# Altium project sensorbox.PrjPCB
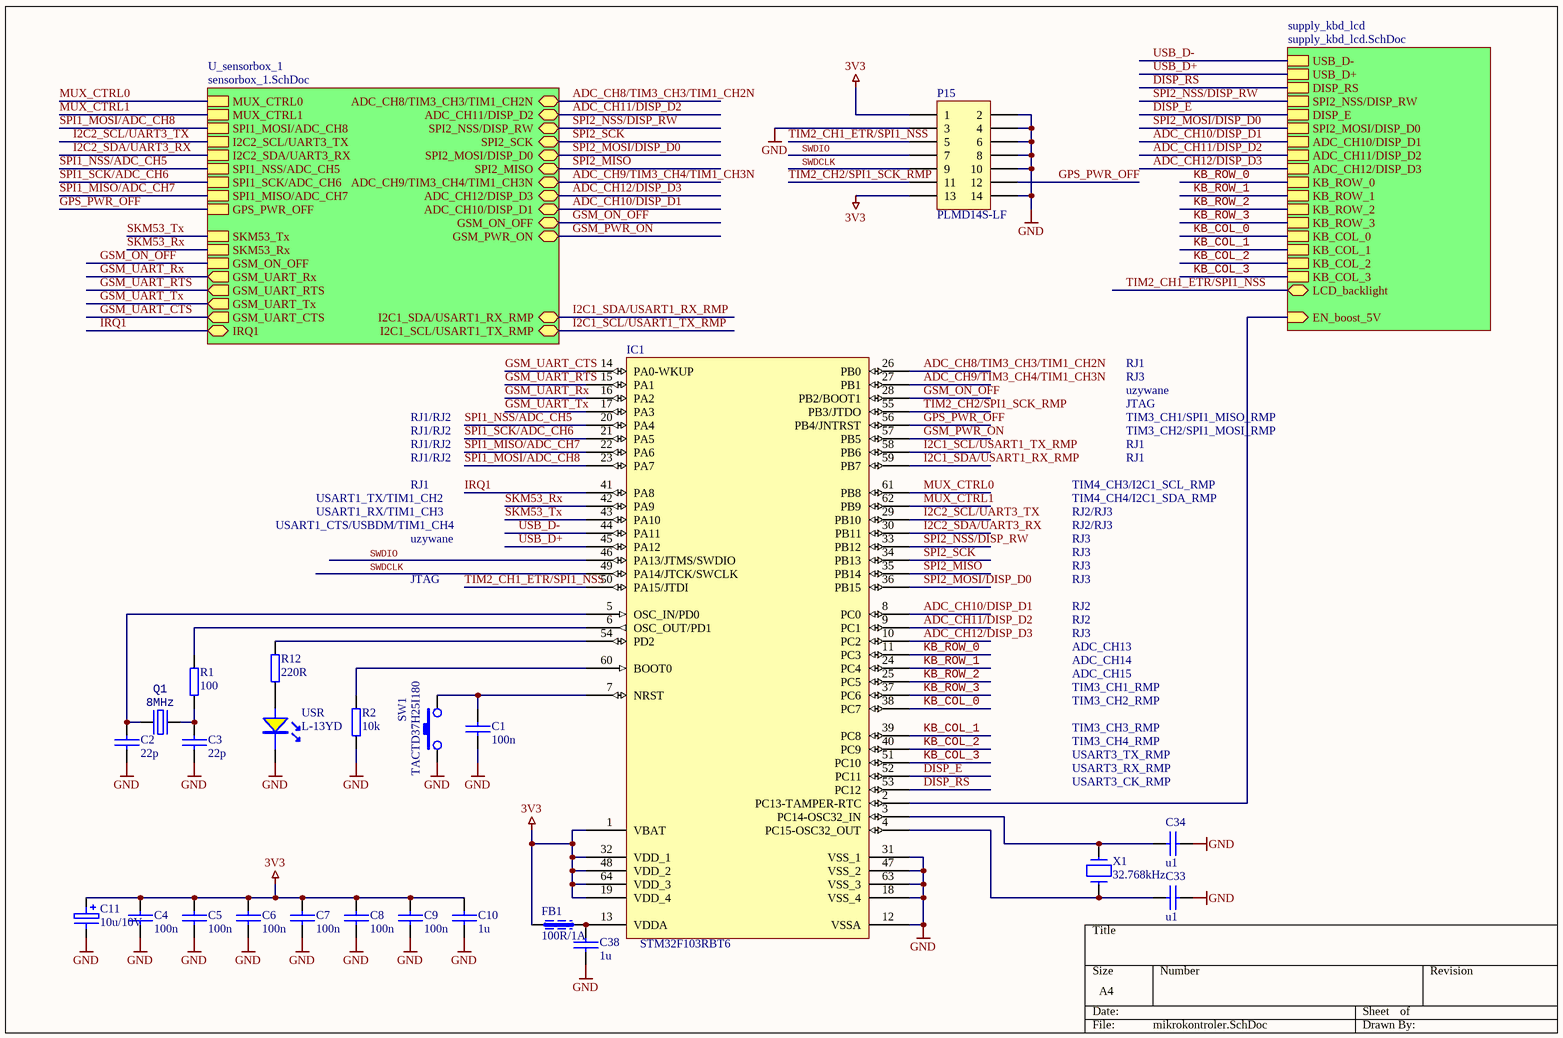
[diagram p0: mikrokontroler.SchDoc]
5 sheets, 118 parts. Net scope: hierarchical (ports join the sheet entries above them; power ports are global).
Board file: sensorbox.PcbDoc
Sheets:
  mikrokontroler.SchDoc
    supply_kbd_lcd = supply_kbd_lcd.SchDoc
    U_sensorbox_1 = sensorbox_1.SchDoc
      U_rj50 = rj50.SchDoc
      alt modem = alt_modem.SchDoc

## Sheet mikrokontroler.SchDoc
size A4

### Parts
C1  100n  [0603C]
C2  22p  [0603C]
C3  22p  [0603C]
C4  100n  [0603C]
C5  100n  [0603C]
C6  100n  [0603C]
C7  100n  [0603C]
C8  100n  [0603C]
C9  100n  [0603C]
C10  1u  [0603C]
C11  10u/10V  [1411_SMDB]
C33  u1  [0603]
C34  u1  [0603]
C38  1u  [0603C]
FB1  100R/1A  [0603L]
IC1  STM32F103RBT6  [LQFP64_N]
P15  PLMD14S-LF  [HDR2X7H]
Q1  8MHz  [HC-49SM]
R1  100  [0603R]
R2  10k  [0603R]
R12  220R  [0603R]
SW1  TACTD37H25I180  [TACTD37H25I180]
USR  L-13YD  [LED_L-13YD]
X1  32.768kHz  [crystal_85SMX]

### Sub-sheets
supply_kbd_lcd = supply_kbd_lcd.SchDoc: USB_D-, USB_D+, DISP_RS, SPI2_NSS/DISP_RW, DISP_E, SPI2_MOSI/DISP_D0, ADC_CH10/DISP_D1, ADC_CH11/DISP_D2, ADC_CH12/DISP_D3, KB_ROW_0, KB_ROW_1, KB_ROW_2, KB_ROW_3, KB_COL_0, KB_COL_1, KB_COL_2, KB_COL_3, LCD_backlight, EN_boost_5V (in)
U_sensorbox_1 = sensorbox_1.SchDoc: MUX_CTRL0, MUX_CTRL1, SPI1_MOSI/ADC_CH8, I2C2_SCL/UART3_TX, I2C2_SDA/UART3_RX, SPI1_NSS/ADC_CH5, SPI1_SCK/ADC_CH6, SPI1_MISO/ADC_CH7, GPS_PWR_OFF, SKM53_Tx, SKM53_Rx, GSM_UART_Rx (out), GSM_UART_RTS (out), GSM_UART_Tx (out), GSM_UART_CTS (out), GSM_ON_OFF, IRQ1, I2C1_SDA/USART1_RX_RMP, I2C1_SCL/USART1_TX_RMP, ADC_CH8/TIM3_CH3/TIM1_CH2N, ADC_CH11/DISP_D2, SPI2_NSS/DISP_RW, SPI2_SCK, SPI2_MOSI/DISP_D0, ADC_CH9/TIM3_CH4/TIM1_CH3N, ADC_CH12/DISP_D3, ADC_CH10/DISP_D1, GSM_ON_OFF, SPI2_MISO, GSM_PWR_ON

### Nets
3V3: C4.1 C5.1 C6.1 C7.1 C8.1 C9.1 C10.1 C11.1 FB1.1 IC1.1(VBAT) IC1.19(VDD_4) IC1.32(VDD_1) IC1.48(VDD_2) IC1.64(VDD_3) P15.1 P15.13
GND: C1.2 C2.2 C3.2 C4.2 C5.2 C6.2 C7.2 C8.2 C9.2 C10.2 C11.2 C33.2 C34.2 C38.2 IC1.12(VSSA) IC1.18(VSS_4) IC1.31(VSS_1) IC1.47(VSS_2) IC1.63(VSS_3) P15.2 P15.3 P15.4 P15.6 P15.8 P15.10 P15.14 R2.2 SW1.1 USR.K
ADC_CH8/TIM3_CH3/TIM1_CH2N: IC1.26(PB0) ; sheet U_sensorbox_1/ADC_CH8/TIM3_CH3/TIM1_CH2N
ADC_CH9/TIM3_CH4/TIM1_CH3N: IC1.27(PB1) ; sheet U_sensorbox_1/ADC_CH9/TIM3_CH4/TIM1_CH3N
ADC_CH10/DISP_D1: IC1.8(PC0) ; sheet supply_kbd_lcd/ADC_CH10/DISP_D1, sheet U_sensorbox_1/ADC_CH10/DISP_D1
ADC_CH11/DISP_D2: IC1.9(PC1) ; sheet supply_kbd_lcd/ADC_CH11/DISP_D2, sheet U_sensorbox_1/ADC_CH11/DISP_D2
ADC_CH12/DISP_D3: IC1.10(PC2) ; sheet supply_kbd_lcd/ADC_CH12/DISP_D3, sheet U_sensorbox_1/ADC_CH12/DISP_D3
DISP_E: IC1.52(PC11) ; sheet supply_kbd_lcd/DISP_E
DISP_RS: IC1.53(PC12) ; sheet supply_kbd_lcd/DISP_RS
GPS_PWR_OFF: IC1.56(PB4/JNTRST) P15.12 ; sheet U_sensorbox_1/GPS_PWR_OFF
GSM_ON_OFF: IC1.28(PB2/BOOT1) ; sheet U_sensorbox_1/GSM_ON_OFF, sheet U_sensorbox_1/GSM_ON_OFF
GSM_PWR_ON: IC1.57(PB5) ; sheet U_sensorbox_1/GSM_PWR_ON
GSM_UART_CTS: IC1.14(PA0-WKUP) ; sheet U_sensorbox_1/GSM_UART_CTS
GSM_UART_RTS: IC1.15(PA1) ; sheet U_sensorbox_1/GSM_UART_RTS
GSM_UART_Rx: IC1.16(PA2) ; sheet U_sensorbox_1/GSM_UART_Rx
GSM_UART_Tx: IC1.17(PA3) ; sheet U_sensorbox_1/GSM_UART_Tx
I2C1_SCL/USART1_TX_RMP: IC1.58(PB6) ; sheet U_sensorbox_1/I2C1_SCL/USART1_TX_RMP
I2C1_SDA/USART1_RX_RMP: IC1.59(PB7) ; sheet U_sensorbox_1/I2C1_SDA/USART1_RX_RMP
I2C2_SCL/UART3_TX: IC1.29(PB10) ; sheet U_sensorbox_1/I2C2_SCL/UART3_TX
I2C2_SDA/UART3_RX: IC1.30(PB11) ; sheet U_sensorbox_1/I2C2_SDA/UART3_RX
IRQ1: IC1.41(PA8) ; sheet U_sensorbox_1/IRQ1
KB_COL_0: IC1.38(PC7) ; sheet supply_kbd_lcd/KB_COL_0
KB_COL_1: IC1.39(PC8) ; sheet supply_kbd_lcd/KB_COL_1
KB_COL_2: IC1.40(PC9) ; sheet supply_kbd_lcd/KB_COL_2
KB_COL_3: IC1.51(PC10) ; sheet supply_kbd_lcd/KB_COL_3
KB_ROW_0: IC1.11(PC3) ; sheet supply_kbd_lcd/KB_ROW_0
KB_ROW_1: IC1.24(PC4) ; sheet supply_kbd_lcd/KB_ROW_1
KB_ROW_2: IC1.25(PC5) ; sheet supply_kbd_lcd/KB_ROW_2
KB_ROW_3: IC1.37(PC6) ; sheet supply_kbd_lcd/KB_ROW_3
MUX_CTRL0: IC1.61(PB8) ; sheet U_sensorbox_1/MUX_CTRL0
MUX_CTRL1: IC1.62(PB9) ; sheet U_sensorbox_1/MUX_CTRL1
SKM53_Rx: IC1.42(PA9) ; sheet U_sensorbox_1/SKM53_Rx
SKM53_Tx: IC1.43(PA10) ; sheet U_sensorbox_1/SKM53_Tx
SPI1_MISO/ADC_CH7: IC1.22(PA6) ; sheet U_sensorbox_1/SPI1_MISO/ADC_CH7
SPI1_MOSI/ADC_CH8: IC1.23(PA7) ; sheet U_sensorbox_1/SPI1_MOSI/ADC_CH8
SPI1_NSS/ADC_CH5: IC1.20(PA4) ; sheet U_sensorbox_1/SPI1_NSS/ADC_CH5
SPI1_SCK/ADC_CH6: IC1.21(PA5) ; sheet U_sensorbox_1/SPI1_SCK/ADC_CH6
SPI2_MISO: IC1.35(PB14) ; sheet U_sensorbox_1/SPI2_MISO
SPI2_MOSI/DISP_D0: IC1.36(PB15) ; sheet supply_kbd_lcd/SPI2_MOSI/DISP_D0, sheet U_sensorbox_1/SPI2_MOSI/DISP_D0
SPI2_NSS/DISP_RW: IC1.33(PB12) ; sheet supply_kbd_lcd/SPI2_NSS/DISP_RW, sheet U_sensorbox_1/SPI2_NSS/DISP_RW
SPI2_SCK: IC1.34(PB13) ; sheet U_sensorbox_1/SPI2_SCK
SWDCLK: IC1.49(PA14/JTCK/SWCLK) P15.9
SWDIO: IC1.46(PA13/JTMS/SWDIO) P15.7
TIM2_CH1_ETR/SPI1_NSS: IC1.50(PA15/JTDI) P15.5 ; sheet supply_kbd_lcd/LCD_backlight
TIM2_CH2/SPI1_SCK_RMP: IC1.55(PB3/JTDO) P15.11
USB_D+: IC1.45(PA12) ; sheet supply_kbd_lcd/USB_D+
USB_D-: IC1.44(PA11) ; sheet supply_kbd_lcd/USB_D-
NetC1_1: C1.1 IC1.7(NRST) SW1.2
NetC2_1: C2.1 IC1.5(OSC_IN/PD0) Q1.2(OSC2)
NetC3_1: C3.1 Q1.1(OSC1) R1.1
NetC33_1: C33.1 IC1.4(PC15-OSC32_OUT) X1.1
NetC34_1: C34.1 IC1.3(PC14-OSC32_IN) X1.2
NetC38_1: C38.1 FB1.2 IC1.13(VDDA)
NetIC1_2: IC1.2(PC13-TAMPER-RTC) ; sheet supply_kbd_lcd/EN_boost_5V
NetIC1_6: IC1.6(OSC_OUT/PD1) R1.2
NetIC1_54: IC1.54(PD2) R12.1
NetIC1_60: IC1.60(BOOT0) R2.1
NetR12_2: R12.2 USR.A

### Notes on the sheet
- RJ1
- RJ3
- RJ1/RJ2
- JTAG
- TIM3_CH1/SPI1_MISO_RMP
- TIM3_CH2/SPI1_MOSI_RMP
- uzywane
- USART1_TX/TIM1_CH2
- USART1_RX/TIM1_CH3
- TIM4_CH3/I2C1_SCL_RMP
- TIM4_CH4/I2C1_SDA_RMP
- RJ2/RJ3
- USART1_CTS/USBDM/TIM1_CH4
- RJ2
- ADC_CH13
- ADC_CH14
- ADC_CH15
- TIM3_CH1_RMP
- TIM3_CH2_RMP
- TIM3_CH3_RMP
- TIM3_CH4_RMP
- USART3_TX_RMP
- USART3_RX_RMP
- USART3_CK_RMP

### Library data of the parts
C1-C10 C33 C34 C38 = CAP_general: Capacitor
C11 = CAP_TANTALIUM: Tantalium Capacitor
FB1 = L_FERRITE_BEAD_0603: ferrite bead 100R@100MHz 1A
IC1 = STM32F103RBT6: STM32 ARM-based 32-bit MCU with 128 Kbytes Flash, 64-pin LQFP, Industrial Temperature; Published: 30-May-2008; DatasheetVersion: rev6, Mar-2008; PackageVersion: Mar-2008; PackageReference: LQFP64; Publisher: Altium Limited; PackageDescription: 64-Pin Low-Profile Quad Flat Pack, 10 x 10 mm Body, 0.5 mm Pitch (LQFP64); ComponentLink1Description: Manufacturer Link; ComponentLink1URL: www.st.com/stm32; ComponentLink2Description: Datasheet; ComponentLink2URL: http://www.st.com/stonline/products/literature/ds/13587.pdf
P15 = Header 7X2H: Header, 7-Pin, Dual row, Right Angle; LatestRevisionDate: 17-Jul-2002; LatestRevisionNote: Re-released for DXP Platform.; Publisher: Altium Limited
Q1 = Quartz Crystal: Farnell: 1842268
R1 R2 R12 = RES_0603: SMD Resistor
SW1 = SW-TACT_SMD: Push button
USR = LED_THT_2mm_Y: LED (TME)
X1 = X_CRYSTAL: Crystal oscillator

## Sheet supply_kbd_lcd.SchDoc
size A4
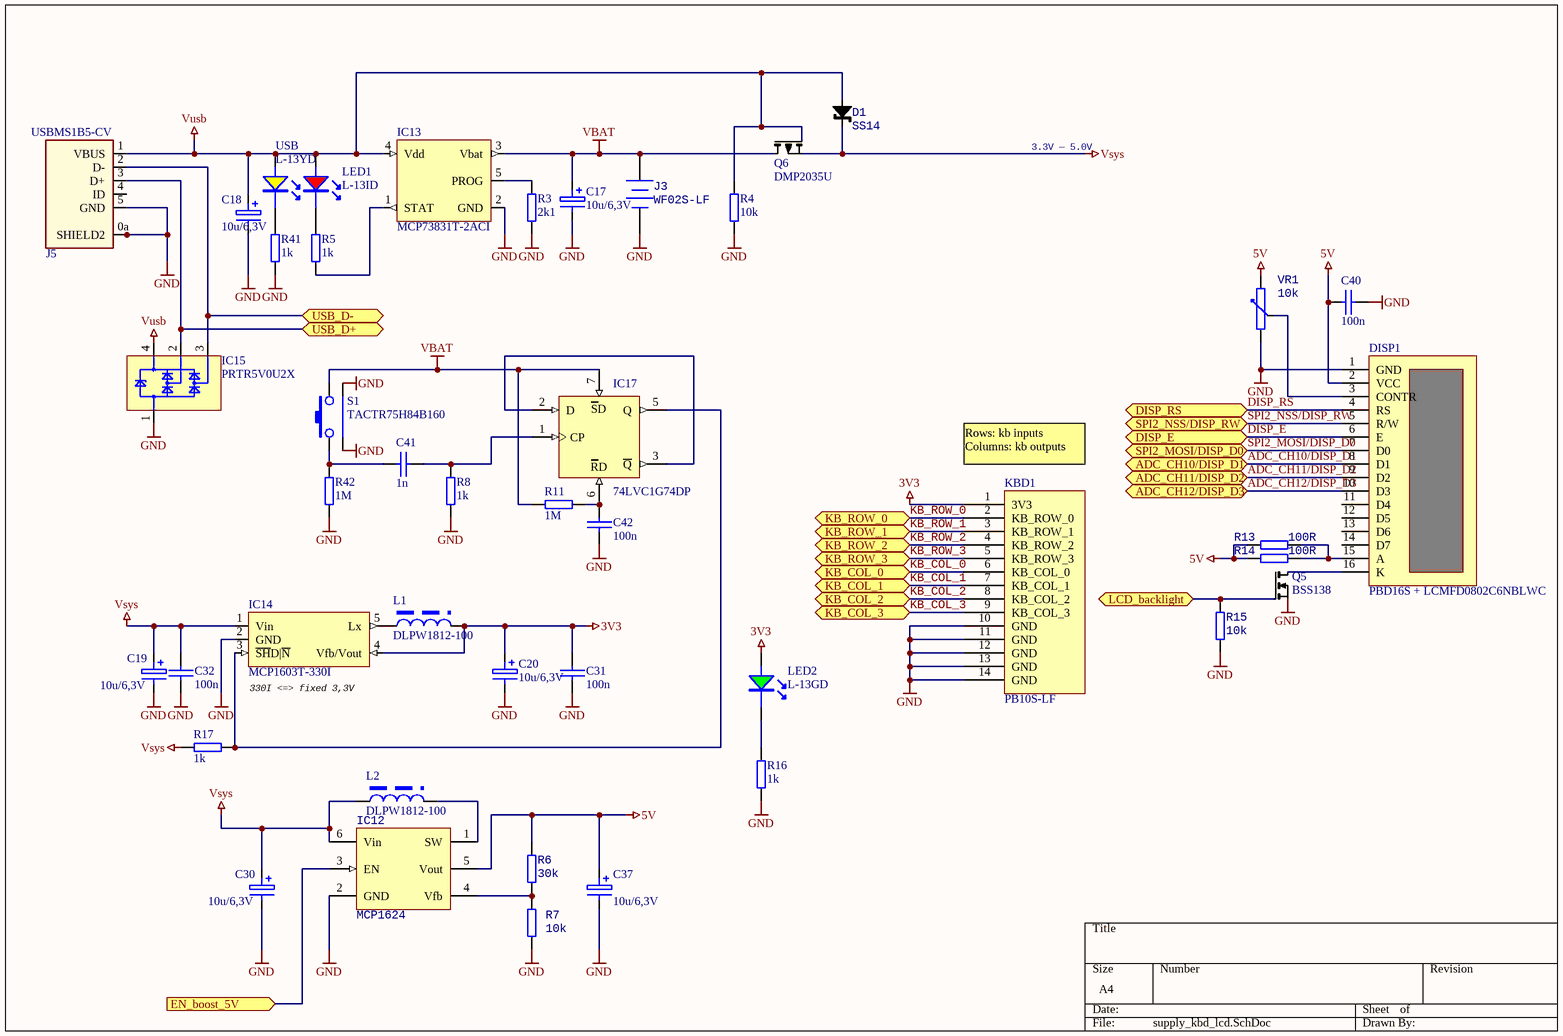
[diagram p1: supply_kbd_lcd.SchDoc]

### Parts
C17  10u/6,3V  [1411_SMDB]
C18  10u/6,3V  [1411_SMDB]
C19  10u/6,3V  [1411_SMDB]
C20  10u/6,3V  [1411_SMDB]
C30  10u/6,3V  [1411_SMDB]
C31  100n  [0603C]
C32  100n  [0603C]
C37  10u/6,3V  [1411_SMDB]
C40  100n  [0603C]
C41  1n  [0603C]
C42  100n  [0603C]
D1  SS14  [DO-214AC/SMA]
DISP1  PBD16S + LCMFD0802C6NBLWC  [IDC16]
IC12  MCP1624  [SOT23-6]
IC13  MCP73831T-2ACI  [SOT23-5]
IC14  MCP1603T-330I  [SOT23-5]
IC15  PRTR5V0U2X  [sot143b]
IC17  74LVC1G74DP  [SOP65P400X110-8N]
J3  WF02S-LF  [CON_WF02S-LF]
J5  USBMS1B5-CV  [USBMS1B5-CV]
KBD1  PB10S-LF  [KBD]
L1  DLPW1812-100  [PW4532]
L2  DLPW1812-100  [PW4532]
LED1  L-13ID  [LED_L-13ID]
LED2  L-13GD  [LED_L-13GD]
Q5  BSS138  [SOT-23]
Q6  DMP2035U  [sot-23]
R3  2k1  [0603R]
R4  10k  [0603R]
R5  1k  [0603R]
R6  30k  [0603R]
R7  10k  [0603R]
R8  1k  [0603R]
R11  1M  [0603R]
R13  100R  [0603R]
R14  100R  [0603R]
R15  10k  [0603R]
R16  1k  [0603R]
R17  1k  [0603R]
R41  1k  [0603R]
R42  1M  [0603R]
S1  TACTR75H84B160  [PB_ALPS_SKHHLQA010]
USB  L-13YD  [LED_L-13YD]
VR1  10k  [POT_RM6v]

### Ports
ADC_CH10/DISP_D1, ADC_CH11/DISP_D2, ADC_CH12/DISP_D3, DISP_E, DISP_RS, EN_boost_5V (in), KB_COL_0, KB_COL_1, KB_COL_2, KB_COL_3, KB_ROW_0, KB_ROW_1, KB_ROW_2, KB_ROW_3, LCD_backlight, SPI2_MOSI/DISP_D0, SPI2_NSS/DISP_RW, USB_D+, USB_D-

### Nets
3V3: C20.1 C31.1 IC14.4(Vfb/Vout) KBD1.1(3V3) L1.2 LED2.A
5V: C37.1 C40.1 DISP1.2(VCC) IC12.5(Vout) R6.2 R13.2 R14.2 VR1.3(U)
GND: C17.2 C18.2 C19.2 C20.2 C30.2 C31.2 C32.2 C37.2 C40.2 C42.1 DISP1.1(GND) IC12.2(GND) IC13.2(GND) IC14.2(GND) IC15.1 IC17.4(GND) J3.2(-) J5.0a(SHIELD2) J5.0b(SHIELD2) J5.0c(SHIELD2) J5.0d(SHIELD2) J5.5(GND) KBD1.10(GND) KBD1.11(GND) KBD1.12(GND) KBD1.13(GND) KBD1.14(GND) Q5.2(S) R3.1 R4.1 R7.1 R8.1 R15.1 R16.2 R41.2 R42.2 S1.3 S1.4 VR1.1(D)
VBAT: C17.1 IC13.3(Vbat) IC17.7(~{S}D) IC17.8(VCC) J3.1(+) Q6.3(D) R11.1 S1.2
Vsys: C19.1 C30.1 C32.1 D1.K IC12.6(Vin) IC14.1(Vin) L2.1 Q6.2(S) R17.2
Vusb: C18.1 D1.A IC13.4(Vdd) IC15.4 J5.1(VBUS) LED1.A Q6.1(G) R4.2 USB.A
ADC_CH10/DISP_D1: DISP1.8(D1) ; port ADC_CH10/DISP_D1
ADC_CH11/DISP_D2: DISP1.9(D2) ; port ADC_CH11/DISP_D2
ADC_CH12/DISP_D3: DISP1.10(D3) ; port ADC_CH12/DISP_D3
DISP_E: DISP1.6(E) ; port DISP_E
DISP_RS: DISP1.4(RS) ; port DISP_RS
KB_COL_0: KBD1.6(KB_COL_0) ; port KB_COL_0
KB_COL_1: KBD1.7(KB_COL_1) ; port KB_COL_1
KB_COL_2: KBD1.8(KB_COL_2) ; port KB_COL_2
KB_COL_3: KBD1.9(KB_COL_3) ; port KB_COL_3
KB_ROW_0: KBD1.2(KB_ROW_0) ; port KB_ROW_0
KB_ROW_1: KBD1.3(KB_ROW_1) ; port KB_ROW_1
KB_ROW_2: KBD1.4(KB_ROW_2) ; port KB_ROW_2
KB_ROW_3: KBD1.5(KB_ROW_3) ; port KB_ROW_3
SPI2_MOSI/DISP_D0: DISP1.7(D0) ; port SPI2_MOSI/DISP_D0
SPI2_NSS/DISP_RW: DISP1.5(R/W) ; port SPI2_NSS/DISP_RW
TIM2_CH1_ETR/SPI1_NSS: Q5.1(G) R15.2 ; port LCD_backlight
USB_D+: IC15.2 J5.3(D+) ; port USB_D+
USB_D-: IC15.3 J5.2(D-) ; port USB_D-
NetC41_1: C41.1 R42.1 S1.1
NetC41_2: C41.2 IC17.1(CP) R8.2
NetC42_2: C42.2 IC17.6(~{RD}) R11.2
NetDISP1_3: DISP1.3(CONTR) VR1.2(W)
NetDISP1_15: DISP1.15(A) R13.1 R14.1
NetDISP1_16: DISP1.16(K) Q5.3(D)
NetIC1_2: IC12.3(EN) ; port EN_boost_5V
NetIC12_1: IC12.1(SW) L2.2
NetIC12_4: IC12.4(Vfb) R6.1 R7.2
NetIC13_1: IC13.1(STAT) R5.2
NetIC13_5: IC13.5(PROG) R3.2
NetIC14_3: IC14.3(~{SH}D|~{N}) IC17.5(Q) R17.1
NetIC14_5: IC14.5(Lx) L1.1
NetIC17_2: IC17.2(D) IC17.3(~{Q})
NetLED1_K: LED1.K R5.1
NetLED2_K: LED2.K R16.1
NetR41_1: R41.1 USB.K

Not connected (* = marked no-connect by the designer): DISP1 11(D4) 12(D5) 13(D6) 14(D7); J5 4(ID)

### Notes on the sheet
- 3.3V — 5.0V
- (near KBD1) Rows: kb inputs
  Columns: kb outputs
- (near IC14) 330I <=> fixed 3,3V
- (in symbol 74LVC1G74DP) SD; RD

### Library data of the parts
C17-C20 C30 C37 = CAP_TANTALIUM: Tantalium Capacitor
C31 C32 C40-C42 = CAP_general: Capacitor
D1 = D_LS101A: Schottky, 60V, 1A; Farnell: 1456528
DISP1 = LCD_HD44780_LED: LCD character display socket with backlight
IC12 = DC/DC_MCP1640: Adjustable 5V/350mA Step-up DC/DC converter (TME)
IC13 = REG_MCP73831: Single-Cell, Fully Integrated Li-Ion charger
IC14 = PWM_MCP1603T: 3.3V. 500mA buck regulator
IC15 = D_TVS_PRTR5V0U2X: dual 5.5 ESD transient voltage suppressor
IC17 = 74LVC1G74DP: Single D-type flip-flop with set and reset, positive edge trigger; Manufacturer: NXP SEMICONDUCTORS; Table: Standard Logic; Part Number: 74LVC1G74DP; Component Kind: Standard; Component Type: Standard; Device: 74LVC1G74DP; PackageDescription: SOP, 0.65mm, pitch; 8 pin, 3.00mm W X 3.00mm L X 1.10mm H body, PC Medium Density; Part Description: Single D-Type Flip-Flop With Set And Reset, Positive Edge Trigger; Manufacturer Part Number: 74LVC1G74DP; Pin Count: 8; Case: TSSOP8; Mounted: Yes; Socket: No; SMD: Yes; ComponentHeight: 1.1mm; Author: CERN DEM JLC; HelpURL: \\cern.ch\dfs\Applications\Altium\Datasheets\74LVC1G74DP.pdf; CreateDate: 2010-04-26; LatestRevisionDate: 2010-04-26
J3 = Battery: Multicell Battery; Published: 24-Mar-1999; LatestRevisionDate: 17-Jul-2002; LatestRevisionNote: Re-released for DXP Platform.; PackageReference: BAT-2; Publisher: Altium Limited; PackageDescription: Battery; 2 Leads
J5 = CON_USB_B_MINI: USB mini B connector (Maritex); Part Number: 10133; Device: USB_Mini_AB
KBD1 = KBD_4x4_10pin: pin to pad: 11>10a 12>10b 13>10c 14>10d
L1 L2 = L_POWER_PW4532: SMT power inductor , Maritex,
LED1 = LED_THT_2mm_R: LED (TME)
LED2 = LED_THT_2mm_G: LED (TME)
Q5 = Q_BSS138
Q6 = Q_BSS84: P MOSFET 50V, 0.36W, 0.15A
R3-R8 R11 R13-R17 R41 R42 = RES_0603: SMD Resistor
S1 = SW-PB_RA_5.8mm: Push button
USB = LED_THT_2mm_Y: LED (TME)
VR1 = TRIMPOT_RM6_HOR: Carbon trimpot, 0.1W, +/- 30%; Farnell: 1227558

## Sheet sensorbox_1.SchDoc
size A4
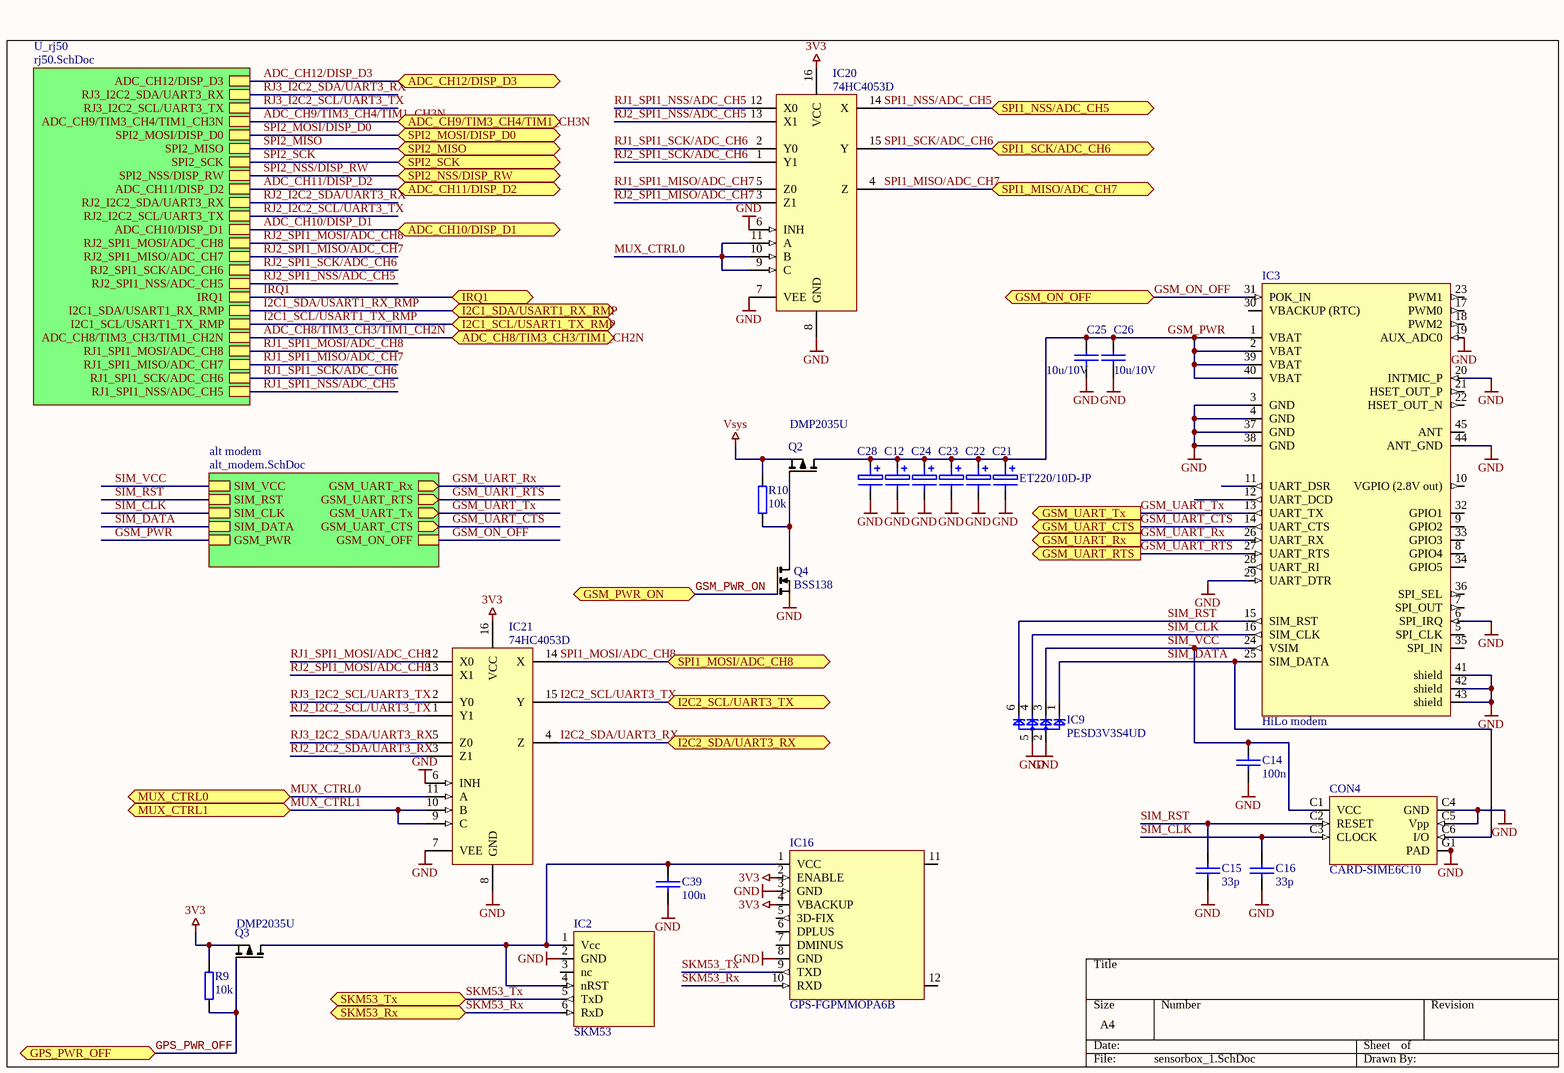
[diagram p2: sensorbox_1.SchDoc]

### Parts
C12  ET220/10D-JP  [2917_SMDD]
C14  100n  [0603C]
C15  33p  [0603C]
C16  33p  [0603C]
C21  ET220/10D-JP  [2917_SMDD]  (value not drawn)
C22  ET220/10D-JP  [2917_SMDD]  (value not drawn)
C23  ET220/10D-JP  [2917_SMDD]  (value not drawn)
C24  ET220/10D-JP  [2917_SMDD]  (value not drawn)
C25  10u/10V  [0805C]
C26  10u/10V  [0805C]
C28  ET220/10D-JP  [2917_SMDD]  (value not drawn)
C39  100n  [0603C]
CON4  CARD-SIME6C10  [CON_CARD-SIME6C10]
IC2  SKM53  [RF_GPS_SKM53]
IC3  HiLo modem  [MOLEX_54102-0403]
IC9  PESD3V3S4UD  [SOT23-6]
IC16  GPS-FGPMMOPA6B  [GPS-FGPMMOPA6B]
IC20  74HC4053D  [SO-16]
IC21  74HC4053D  [SO-16]
Q2  DMP2035U  [sot-23]
Q3  DMP2035U  [sot-23]
Q4  BSS138  [SOT-23]
R9  10k  [0603R]
R10  10k  [0603R]

### Sub-sheets
alt modem = alt_modem.SchDoc: GSM_UART_Rx (out), GSM_UART_RTS (out), GSM_UART_Tx (out), GSM_UART_CTS (out), SIM_VCC, SIM_RST, SIM_CLK, SIM_DATA, GSM_PWR, GSM_ON_OFF
U_rj50 = rj50.SchDoc: RJ1_SPI1_NSS/ADC_CH5, RJ1_SPI1_SCK/ADC_CH6, RJ1_SPI1_MISO/ADC_CH7, RJ1_SPI1_MOSI/ADC_CH8, ADC_CH8/TIM3_CH3/TIM1_CH2N, I2C1_SCL/USART1_TX_RMP, I2C1_SDA/USART1_RX_RMP, IRQ1, RJ2_SPI1_NSS/ADC_CH5, RJ2_SPI1_SCK/ADC_CH6, RJ2_SPI1_MISO/ADC_CH7, RJ2_SPI1_MOSI/ADC_CH8, ADC_CH10/DISP_D1, RJ2_I2C2_SCL/UART3_TX, RJ2_I2C2_SDA/UART3_RX, ADC_CH11/DISP_D2, SPI2_NSS/DISP_RW, SPI2_SCK, SPI2_MISO, SPI2_MOSI/DISP_D0, ADC_CH9/TIM3_CH4/TIM1_CH3N, RJ3_I2C2_SCL/UART3_TX, RJ3_I2C2_SDA/UART3_RX, ADC_CH12/DISP_D3

### Ports
ADC_CH8/TIM3_CH3/TIM1_CH2N, ADC_CH9/TIM3_CH4/TIM1_CH3N, ADC_CH10/DISP_D1, ADC_CH11/DISP_D2, ADC_CH12/DISP_D3, GPS_PWR_OFF, GSM_ON_OFF, GSM_PWR_ON, GSM_UART_CTS (out), GSM_UART_RTS (out), GSM_UART_Rx (out), GSM_UART_Tx (out), I2C1_SCL/USART1_TX_RMP, I2C1_SDA/USART1_RX_RMP, I2C2_SCL/UART3_TX, I2C2_SDA/UART3_RX, IRQ1, MUX_CTRL0, MUX_CTRL1, SKM53_Rx, SKM53_Tx, SPI1_MISO/ADC_CH7, SPI1_MOSI/ADC_CH8, SPI1_NSS/ADC_CH5, SPI1_SCK/ADC_CH6, SPI2_MISO, SPI2_MOSI/DISP_D0, SPI2_NSS/DISP_RW, SPI2_SCK

### Nets
3V3: IC16.2(ENABLE) IC16.4(VBACKUP) IC20.16(VCC) IC21.16(VCC) Q3.2(S) R9.2
GND: C12.2 C14.2 C15.2 C16.2 C21.2 C22.2 C23.2 C24.2 C25.1 C26.2 C28.2 C39.2 CON4.C4(GND) CON4.C5(Vpp) CON4.G1(PAD) CON4.G2(GND) CON4.G3(GND) CON4.G4(GND) IC2.2(GND) IC3.3(GND) IC3.4(GND) IC3.6(SPI_IRQ) IC3.19(AUX_ADC0) IC3.20(INTMIC_P) IC3.29(UART_DTR) IC3.37(GND) IC3.38(GND) IC3.41(shield) IC3.42(shield) IC3.43(shield) IC3.44(ANT_GND) IC9.2 IC9.5 IC16.3(GND) IC16.8(GND) IC20.6(INH) IC20.7(VEE) IC20.8(GND) IC21.6(INH) IC21.7(VEE) IC21.8(GND) Q4.2(S)
Vsys: Q2.2(S) R10.2
ADC_CH8/TIM3_CH3/TIM1_CH2N: port ADC_CH8/TIM3_CH3/TIM1_CH2N, sheet U_rj50/ADC_CH8/TIM3_CH3/TIM1_CH2N
ADC_CH9/TIM3_CH4/TIM1_CH3N: port ADC_CH9/TIM3_CH4/TIM1_CH3N, sheet U_rj50/ADC_CH9/TIM3_CH4/TIM1_CH3N
ADC_CH10/DISP_D1: port ADC_CH10/DISP_D1, sheet U_rj50/ADC_CH10/DISP_D1
ADC_CH11/DISP_D2: port ADC_CH11/DISP_D2, sheet U_rj50/ADC_CH11/DISP_D2
ADC_CH12/DISP_D3: port ADC_CH12/DISP_D3, sheet U_rj50/ADC_CH12/DISP_D3
GPS_PWR_OFF: Q3.1(G) R9.1 ; port GPS_PWR_OFF
GSM_ON_OFF: IC3.31(POK_IN) ; port GSM_ON_OFF, sheet alt modem/GSM_ON_OFF
GSM_PWR: C12.1 C21.1 C22.1 C23.1 C24.1 C25.2 C26.1 C28.1 IC3.1(VBAT) IC3.2(VBAT) IC3.39(VBAT) IC3.40(VBAT) Q2.3(D) ; sheet alt modem/GSM_PWR
GSM_PWR_ON: Q4.1(G) ; port GSM_PWR_ON
GSM_UART_CTS: IC3.14(UART_CTS) ; port GSM_UART_CTS, sheet alt modem/GSM_UART_CTS
GSM_UART_RTS: IC3.27(UART_RTS) ; port GSM_UART_RTS, sheet alt modem/GSM_UART_RTS
GSM_UART_Rx: IC3.26(UART_RX) ; port GSM_UART_Rx, sheet alt modem/GSM_UART_Rx
GSM_UART_Tx: IC3.13(UART_TX) ; port GSM_UART_Tx, sheet alt modem/GSM_UART_Tx
I2C1_SCL/USART1_TX_RMP: port I2C1_SCL/USART1_TX_RMP, sheet U_rj50/I2C1_SCL/USART1_TX_RMP
I2C1_SDA/USART1_RX_RMP: port I2C1_SDA/USART1_RX_RMP, sheet U_rj50/I2C1_SDA/USART1_RX_RMP
I2C2_SCL/UART3_TX: IC21.15(Y) ; port I2C2_SCL/UART3_TX
I2C2_SDA/UART3_RX: IC21.4(Z) ; port I2C2_SDA/UART3_RX
IRQ1: port IRQ1, sheet U_rj50/IRQ1
MUX_CTRL0: IC20.9(C) IC20.10(B) IC20.11(A) IC21.11(A) ; port MUX_CTRL0
MUX_CTRL1: IC21.9(C) IC21.10(B) ; port MUX_CTRL1
RJ1_SPI1_MISO/ADC_CH7: IC20.5(Z0) ; sheet U_rj50/RJ1_SPI1_MISO/ADC_CH7
RJ1_SPI1_MOSI/ADC_CH8: IC21.12(X0) ; sheet U_rj50/RJ1_SPI1_MOSI/ADC_CH8
RJ1_SPI1_NSS/ADC_CH5: IC20.12(X0) ; sheet U_rj50/RJ1_SPI1_NSS/ADC_CH5
RJ1_SPI1_SCK/ADC_CH6: IC20.2(Y0) ; sheet U_rj50/RJ1_SPI1_SCK/ADC_CH6
RJ2_I2C2_SCL/UART3_TX: IC21.1(Y1) ; sheet U_rj50/RJ2_I2C2_SCL/UART3_TX
RJ2_I2C2_SDA/UART3_RX: IC21.3(Z1) ; sheet U_rj50/RJ2_I2C2_SDA/UART3_RX
RJ2_SPI1_MISO/ADC_CH7: IC20.3(Z1) ; sheet U_rj50/RJ2_SPI1_MISO/ADC_CH7
RJ2_SPI1_MOSI/ADC_CH8: IC21.13(X1) ; sheet U_rj50/RJ2_SPI1_MOSI/ADC_CH8
RJ2_SPI1_NSS/ADC_CH5: IC20.13(X1) ; sheet U_rj50/RJ2_SPI1_NSS/ADC_CH5
RJ2_SPI1_SCK/ADC_CH6: IC20.1(Y1) ; sheet U_rj50/RJ2_SPI1_SCK/ADC_CH6
RJ3_I2C2_SCL/UART3_TX: IC21.2(Y0) ; sheet U_rj50/RJ3_I2C2_SCL/UART3_TX
RJ3_I2C2_SDA/UART3_RX: IC21.5(Z0) ; sheet U_rj50/RJ3_I2C2_SDA/UART3_RX
SIM_CLK: C16.1 CON4.C3(CLOCK) IC3.16(SIM_CLK) IC9.4 ; sheet alt modem/SIM_CLK
SIM_DATA: CON4.C6(I/O) IC3.25(SIM_DATA) IC9.1 ; sheet alt modem/SIM_DATA
SIM_RST: C15.1 CON4.C2(RESET) IC3.15(SIM_RST) IC9.6 ; sheet alt modem/SIM_RST
SIM_VCC: C14.1 CON4.C1(VCC) IC3.24(VSIM) IC9.3 ; sheet alt modem/SIM_VCC
SKM53_Rx: IC2.6(RxD) IC16.10(RXD) ; port SKM53_Rx
SKM53_Tx: IC2.5(TxD) IC16.9(TXD) ; port SKM53_Tx
SPI1_MISO/ADC_CH7: IC20.4(Z) ; port SPI1_MISO/ADC_CH7
SPI1_MOSI/ADC_CH8: IC21.14(X) ; port SPI1_MOSI/ADC_CH8
SPI1_NSS/ADC_CH5: IC20.14(X) ; port SPI1_NSS/ADC_CH5
SPI1_SCK/ADC_CH6: IC20.15(Y) ; port SPI1_SCK/ADC_CH6
SPI2_MISO: port SPI2_MISO, sheet U_rj50/SPI2_MISO
SPI2_MOSI/DISP_D0: port SPI2_MOSI/DISP_D0, sheet U_rj50/SPI2_MOSI/DISP_D0
SPI2_NSS/DISP_RW: port SPI2_NSS/DISP_RW, sheet U_rj50/SPI2_NSS/DISP_RW
SPI2_SCK: port SPI2_SCK, sheet U_rj50/SPI2_SCK
NetC39_1: C39.1 IC2.1(Vcc) IC2.4(nRST) IC16.1(VCC) Q3.3(D)
NetQ2_1: Q2.1(G) Q4.3(D) R10.1

Not connected (* = marked no-connect by the designer): IC2 3(nc); IC3 5(SPI_CLK) 7(SPI_OUT) 8(GPIO4) 9(GPIO2) 10(VGPIO_(2.8V_out)) 11(UART_DSR) 12(UART_DCD) 17(PWM0) 18(PWM2) 21(HSET_OUT_P) 22(HSET_OUT_N) 23(PWM1) 28(UART_RI) 30(VBACKUP_(RTC)) 32(GPIO1) 33(GPIO3) 34(GPIO5) 35(SPI_IN) 36(SPI_SEL) 45(ANT); IC16 5(3D-FIX) 6(DPLUS) 7(DMINUS) 11 12

### Library data of the parts
C12 C21-C24 C28 = CAP_TANT_SMDD: Tantalium Capacitor
C14-C16 C39 = CAP_general: Capacitor
C25 C26 = CAP_SMD_0805: Capacitor SMD
CON4 = CON_CARD-SIME6C10: Sim Card Holder (Maritex)
IC2 = RF_GPS_SKM53: GPS receiver
IC3 = RF_GSM_Hilo (Sagem): GPRS/EDGE modem (Sagem)
IC9 = D_TVS_BZA462A: Quadruple 4V ESD transient voltage suppressor
IC16 = RF_GPS_FGPMMOPA6B: GPS receiver (Maritex)
IC20 IC21 = 4053
Q2 Q3 = Q_BSS84: P MOSFET 50V, 0.36W, 0.15A
Q4 = Q_BSS138
R9 R10 = RES_0603: SMD Resistor

## Sheet rj50.SchDoc
size A4
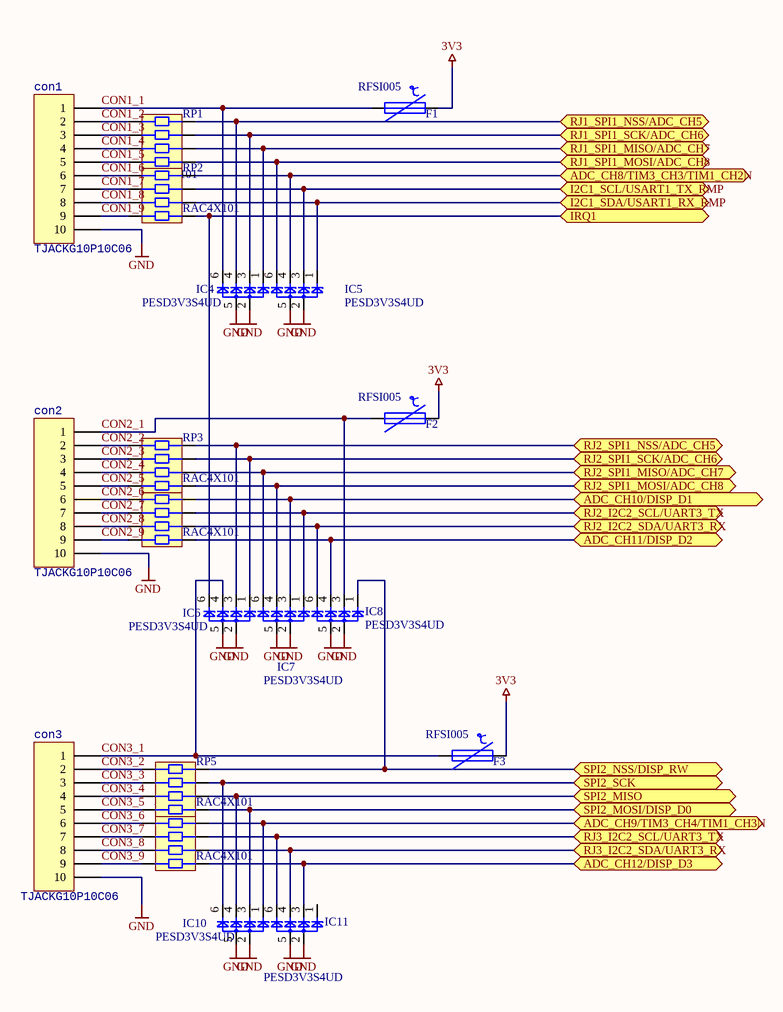
[diagram p3: rj50.SchDoc]

### Parts
con1  TJACKG10P10C06  [TJACKM10P10C03Y-LF]
con2  TJACKG10P10C06  [TJACKM10P10C03Y-LF]
con3  TJACKG10P10C06  [TJACKM10P10C03Y-LF]
F1  RFSI005  [0805R]
F2  RFSI005  [0805R]
F3  RFSI005  [0805R]
IC4  PESD3V3S4UD  [SOT23-6]
IC5  PESD3V3S4UD  [SOT23-6]
IC6  PESD3V3S4UD  [SOT23-6]
IC7  PESD3V3S4UD  [SOT23-6]
IC8  PESD3V3S4UD  [SOT23-6]
IC10  PESD3V3S4UD  [SOT23-6]
IC11  PESD3V3S4UD  [SOT23-6]
RP1  RAC4X101  [CAY-16]
RP2  RAC4X101  [CAY-16]
RP3  RAC4X101  [CAY-16]
RP4  RAC4X101  [CAY-16]
RP5  RAC4X101  [CAY-16]
RP6  RAC4X101  [CAY-16]

### Ports
ADC_CH8/TIM3_CH3/TIM1_CH2N, ADC_CH9/TIM3_CH4/TIM1_CH3N, ADC_CH10/DISP_D1, ADC_CH11/DISP_D2, ADC_CH12/DISP_D3, I2C1_SCL/USART1_TX_RMP, I2C1_SDA/USART1_RX_RMP, IRQ1, RJ1_SPI1_MISO/ADC_CH7, RJ1_SPI1_MOSI/ADC_CH8, RJ1_SPI1_NSS/ADC_CH5, RJ1_SPI1_SCK/ADC_CH6, RJ2_I2C2_SCL/UART3_TX, RJ2_I2C2_SDA/UART3_RX, RJ2_SPI1_MISO/ADC_CH7, RJ2_SPI1_MOSI/ADC_CH8, RJ2_SPI1_NSS/ADC_CH5, RJ2_SPI1_SCK/ADC_CH6, RJ3_I2C2_SCL/UART3_TX, RJ3_I2C2_SDA/UART3_RX, SPI2_MISO, SPI2_MOSI/DISP_D0, SPI2_NSS/DISP_RW, SPI2_SCK

### Nets
3V3: F1.2 F2.2 F3.2
GND: con1.10 con2.10 con3.10 IC4.2 IC4.5 IC5.2 IC5.5 IC6.2 IC6.5 IC7.2 IC7.5 IC8.2 IC8.5 IC10.2 IC10.5 IC11.2 IC11.5
ADC_CH8/TIM3_CH3/TIM1_CH2N: IC5.4 RP2.8 ; port ADC_CH8/TIM3_CH3/TIM1_CH2N
ADC_CH9/TIM3_CH4/TIM1_CH3N: IC10.1 RP6.8 ; port ADC_CH9/TIM3_CH4/TIM1_CH3N
ADC_CH10/DISP_D1: IC7.3 RP4.8 ; port ADC_CH10/DISP_D1
ADC_CH11/DISP_D2: IC8.4 RP4.5 ; port ADC_CH11/DISP_D2
ADC_CH12/DISP_D3: IC11.3 RP6.5 ; port ADC_CH12/DISP_D3
CON1_1: con1.1 F1.1 IC4.6
CON1_2: con1.2 RP1.1
CON1_3: con1.3 RP1.2
CON1_4: con1.4 RP1.3
CON1_5: con1.5 RP1.4
CON1_6: con1.6 RP2.1
CON1_7: con1.7 RP2.2
CON1_8: con1.8 RP2.3
CON1_9: con1.9 RP2.4
CON2_1: con2.1 F2.1 IC8.3
CON2_2: con2.2 RP3.1
CON2_3: con2.3 RP3.2
CON2_4: con2.4 RP3.3
CON2_5: con2.5 RP3.4
CON2_6: con2.6 RP4.1
CON2_7: con2.7 RP4.2
CON2_8: con2.8 RP4.3
CON2_9: con2.9 RP4.4
CON3_1: con3.1 F3.1 IC6.4
CON3_2: con3.2 RP5.1
CON3_3: con3.3 RP5.2
CON3_4: con3.4 RP5.3
CON3_5: con3.5 RP5.4
CON3_6: con3.6 RP6.1
CON3_7: con3.7 RP6.2
CON3_8: con3.8 RP6.3
CON3_9: con3.9 RP6.4
I2C1_SCL/USART1_TX_RMP: IC5.3 RP2.7 ; port I2C1_SCL/USART1_TX_RMP
I2C1_SDA/USART1_RX_RMP: IC5.1 RP2.6 ; port I2C1_SDA/USART1_RX_RMP
IRQ1: IC6.6 RP2.5 ; port IRQ1
RJ1_SPI1_MISO/ADC_CH7: IC4.1 RP1.6 ; port RJ1_SPI1_MISO/ADC_CH7
RJ1_SPI1_MOSI/ADC_CH8: IC5.6 RP1.5 ; port RJ1_SPI1_MOSI/ADC_CH8
RJ1_SPI1_NSS/ADC_CH5: IC4.4 RP1.8 ; port RJ1_SPI1_NSS/ADC_CH5
RJ1_SPI1_SCK/ADC_CH6: IC4.3 RP1.7 ; port RJ1_SPI1_SCK/ADC_CH6
RJ2_I2C2_SCL/UART3_TX: IC7.1 RP4.7 ; port RJ2_I2C2_SCL/UART3_TX
RJ2_I2C2_SDA/UART3_RX: IC8.6 RP4.6 ; port RJ2_I2C2_SDA/UART3_RX
RJ2_SPI1_MISO/ADC_CH7: IC7.6 RP3.6 ; port RJ2_SPI1_MISO/ADC_CH7
RJ2_SPI1_MOSI/ADC_CH8: IC7.4 RP3.5 ; port RJ2_SPI1_MOSI/ADC_CH8
RJ2_SPI1_NSS/ADC_CH5: IC6.3 RP3.8 ; port RJ2_SPI1_NSS/ADC_CH5
RJ2_SPI1_SCK/ADC_CH6: IC6.1 RP3.7 ; port RJ2_SPI1_SCK/ADC_CH6
RJ3_I2C2_SCL/UART3_TX: IC11.6 RP6.7 ; port RJ3_I2C2_SCL/UART3_TX
RJ3_I2C2_SDA/UART3_RX: IC11.4 RP6.6 ; port RJ3_I2C2_SDA/UART3_RX
SPI2_MISO: IC10.4 RP5.6 ; port SPI2_MISO
SPI2_MOSI/DISP_D0: IC10.3 RP5.5 ; port SPI2_MOSI/DISP_D0
SPI2_NSS/DISP_RW: IC8.1 RP5.8 ; port SPI2_NSS/DISP_RW
SPI2_SCK: IC10.6 RP5.7 ; port SPI2_SCK

Not connected (* = marked no-connect by the designer): IC11 1

### Library data of the parts
con1-con3 = CON_RJ50: 10P10C Unshielded Connector (Maritex)
F1-F3 = F_PTC_0.1A: polymer FUSE Maritex
IC4-IC8 IC10 IC11 = D_TVS_BZA462A: as IC9 on sheet sensorbox_1
RP1-RP6 = RES_ARRAY_1206: Resistor network 1206 (4x0402) Maritex RAC4Xxxx

## Sheet alt_modem.SchDoc
size A4
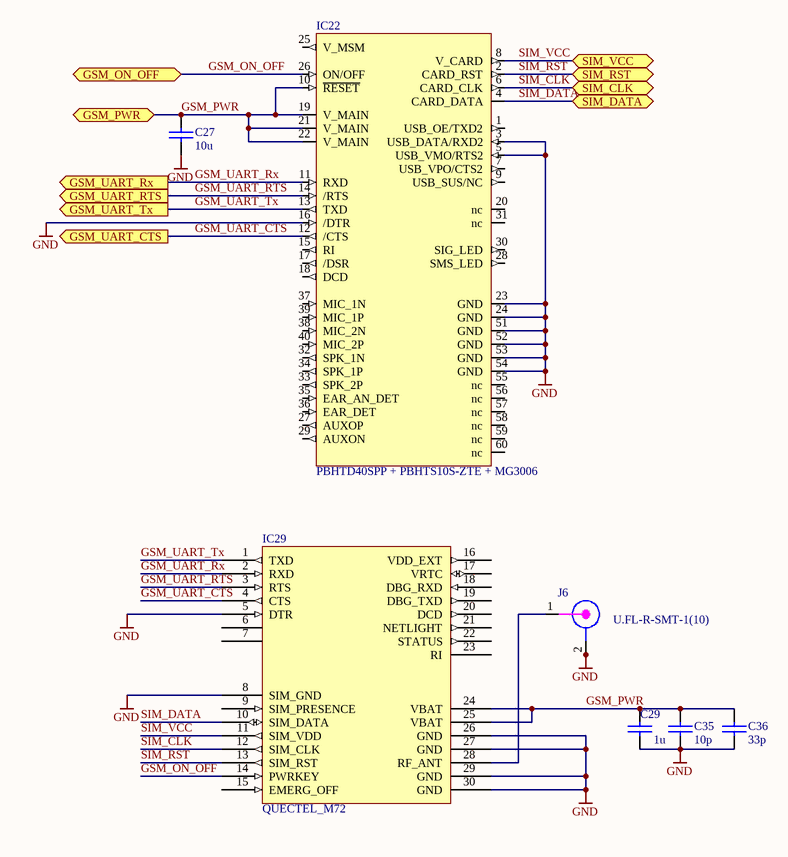
[diagram p4: alt_modem.SchDoc]

### Parts
C27  10u  [0805C]
C29  1u  [0603C]
C35  10p  [0603C]
C36  33p  [0603C]
IC22  PBHTD40SPP + PBHTS10S-ZTE + MG3006  [MG3006]
IC29  QUECTEL_M72  [QUECTEL_M72]
J6  U.FL-R-SMT-1(10)  [CON_UFL_HIROSE_RECEPTACLE]

### Ports
GSM_ON_OFF, GSM_PWR, GSM_UART_CTS (out), GSM_UART_RTS (out), GSM_UART_Rx (out), GSM_UART_Tx (out), SIM_CLK, SIM_DATA, SIM_RST, SIM_VCC

### Nets
GND: C27.2 C29.2 C35.2 C36.2 IC22.3(USB_DATA/RXD2) IC22.5(USB_VMO/RTS2) IC22.16(/DTR) IC22.23(GND) IC22.24(GND) IC22.51(GND) IC22.52(GND) IC22.53(GND) IC22.54(GND) IC29.5(DTR) IC29.8(SIM_GND) IC29.26(GND) IC29.27(GND) IC29.29(GND) IC29.30(GND) J6.2 J6.2a(GND)
GSM_ON_OFF: IC22.26(ON/OFF) IC29.14(PWRKEY) ; port GSM_ON_OFF
GSM_PWR: C27.1 C29.1 C35.1 C36.1 IC22.10(~{RESET}) IC22.19(V_MAIN) IC22.21(V_MAIN) IC22.22(V_MAIN) IC29.24(VBAT) IC29.25(VBAT) ; port GSM_PWR
GSM_UART_CTS: IC22.12(/CTS) IC29.4(CTS) ; port GSM_UART_CTS
GSM_UART_RTS: IC22.14(/RTS) IC29.3(RTS) ; port GSM_UART_RTS
GSM_UART_Rx: IC22.11(RXD) IC29.2(RXD) ; port GSM_UART_Rx
GSM_UART_Tx: IC22.13(TXD) IC29.1(TXD) ; port GSM_UART_Tx
SIM_CLK: IC22.6(CARD_CLK) IC29.12(SIM_CLK) ; port SIM_CLK
SIM_DATA: IC22.4(CARD_DATA) IC29.10(SIM_DATA) ; port SIM_DATA
SIM_RST: IC22.2(CARD_RST) IC29.13(SIM_RST) ; port SIM_RST
SIM_VCC: IC22.8(V_CARD) IC29.11(SIM_VDD) ; port SIM_VCC
NetIC29_28: IC29.28(RF_ANT) J6.1

Not connected (* = marked no-connect by the designer): IC22 1(USB_OE/TXD2) 7(USB_VPO/CTS2) 9(USB_SUS/NC) 15(RI) 17(/DSR) 18(DCD) 20(nc) 25(V_MSM) 27(AUXOP) 28(SMS_LED) 29(AUXON) 30(SIG_LED) 31(nc) 32(SPK_1N) 33(SPK_2P) 34(SPK_1P) 35(EAR_AN_DET) 36(EAR_DET) 37(MIC_1N) 38(MIC_2N) 39(MIC_1P) 40(MIC_2P) 55(nc) 56(nc) 57(nc) 58(nc) 59(nc) 60(nc); IC29 6(Reserved) 7(Reserved) 9(SIM_PRESENCE) 15(EMERG_OFF) 16(VDD_EXT) 17(VRTC) 18(DBG_RXD) 19(DBG_TXD) 20(DCD) 21(NETLIGHT) 22(STATUS) 23(RI)

### Library data of the parts
C27 C29 C35 C36 = CAP_general: Capacitor
IC22 = RF_GSM_MG3006
J6 = CON_UFL_SMD: UFL

## Nets that join several sheets
3V3: mikrokontroler (16 pins), supply_kbd_lcd (6 pins), sensorbox_1 (6 pins), rj50 (F1.2 F2.2 F3.2)
GND: mikrokontroler (29 pins), supply_kbd_lcd (39 pins), sensorbox_1 (42 pins), rj50 (17 pins), alt_modem (21 pins)
Vsys: supply_kbd_lcd (9 pins), sensorbox_1 (Q2.2 R10.2)
ADC_CH8/TIM3_CH3/TIM1_CH2N: mikrokontroler (IC1.26), rj50 (IC5.4 RP2.8)
ADC_CH9/TIM3_CH4/TIM1_CH3N: mikrokontroler (IC1.27), rj50 (IC10.1 RP6.8)
ADC_CH10/DISP_D1: mikrokontroler (IC1.8), supply_kbd_lcd (DISP1.8), rj50 (IC7.3 RP4.8)
ADC_CH11/DISP_D2: mikrokontroler (IC1.9), supply_kbd_lcd (DISP1.9), rj50 (IC8.4 RP4.5)
ADC_CH12/DISP_D3: mikrokontroler (IC1.10), supply_kbd_lcd (DISP1.10), rj50 (IC11.3 RP6.5)
DISP_E: mikrokontroler (IC1.52), supply_kbd_lcd (DISP1.6)
DISP_RS: mikrokontroler (IC1.53), supply_kbd_lcd (DISP1.4)
GPS_PWR_OFF: mikrokontroler (IC1.56 P15.12), sensorbox_1 (Q3.1 R9.1)
GSM_ON_OFF: mikrokontroler (IC1.28), sensorbox_1 (IC3.31), alt_modem (IC22.26 IC29.14)
GSM_PWR: sensorbox_1 (13 pins), alt_modem (10 pins)
GSM_PWR_ON: mikrokontroler (IC1.57), sensorbox_1 (Q4.1)
GSM_UART_CTS: mikrokontroler (IC1.14), sensorbox_1 (IC3.14), alt_modem (IC22.12 IC29.4)
GSM_UART_RTS: mikrokontroler (IC1.15), sensorbox_1 (IC3.27), alt_modem (IC22.14 IC29.3)
GSM_UART_Rx: mikrokontroler (IC1.16), sensorbox_1 (IC3.26), alt_modem (IC22.11 IC29.2)
GSM_UART_Tx: mikrokontroler (IC1.17), sensorbox_1 (IC3.13), alt_modem (IC22.13 IC29.1)
I2C1_SCL/USART1_TX_RMP: mikrokontroler (IC1.58), rj50 (IC5.3 RP2.7)
I2C1_SDA/USART1_RX_RMP: mikrokontroler (IC1.59), rj50 (IC5.1 RP2.6)
I2C2_SCL/UART3_TX: mikrokontroler (IC1.29), sensorbox_1 (IC21.15)
I2C2_SDA/UART3_RX: mikrokontroler (IC1.30), sensorbox_1 (IC21.4)
IRQ1: mikrokontroler (IC1.41), rj50 (IC6.6 RP2.5)
KB_COL_0: mikrokontroler (IC1.38), supply_kbd_lcd (KBD1.6)
KB_COL_1: mikrokontroler (IC1.39), supply_kbd_lcd (KBD1.7)
KB_COL_2: mikrokontroler (IC1.40), supply_kbd_lcd (KBD1.8)
KB_COL_3: mikrokontroler (IC1.51), supply_kbd_lcd (KBD1.9)
KB_ROW_0: mikrokontroler (IC1.11), supply_kbd_lcd (KBD1.2)
KB_ROW_1: mikrokontroler (IC1.24), supply_kbd_lcd (KBD1.3)
KB_ROW_2: mikrokontroler (IC1.25), supply_kbd_lcd (KBD1.4)
KB_ROW_3: mikrokontroler (IC1.37), supply_kbd_lcd (KBD1.5)
MUX_CTRL0: mikrokontroler (IC1.61), sensorbox_1 (IC20.9 IC20.10 IC20.11 IC21.11)
MUX_CTRL1: mikrokontroler (IC1.62), sensorbox_1 (IC21.9 IC21.10)
NetIC1_2: mikrokontroler (IC1.2), supply_kbd_lcd (IC12.3)
RJ1_SPI1_MISO/ADC_CH7: sensorbox_1 (IC20.5), rj50 (IC4.1 RP1.6)
RJ1_SPI1_MOSI/ADC_CH8: sensorbox_1 (IC21.12), rj50 (IC5.6 RP1.5)
RJ1_SPI1_NSS/ADC_CH5: sensorbox_1 (IC20.12), rj50 (IC4.4 RP1.8)
RJ1_SPI1_SCK/ADC_CH6: sensorbox_1 (IC20.2), rj50 (IC4.3 RP1.7)
RJ2_I2C2_SCL/UART3_TX: sensorbox_1 (IC21.1), rj50 (IC7.1 RP4.7)
RJ2_I2C2_SDA/UART3_RX: sensorbox_1 (IC21.3), rj50 (IC8.6 RP4.6)
RJ2_SPI1_MISO/ADC_CH7: sensorbox_1 (IC20.3), rj50 (IC7.6 RP3.6)
RJ2_SPI1_MOSI/ADC_CH8: sensorbox_1 (IC21.13), rj50 (IC7.4 RP3.5)
RJ2_SPI1_NSS/ADC_CH5: sensorbox_1 (IC20.13), rj50 (IC6.3 RP3.8)
RJ2_SPI1_SCK/ADC_CH6: sensorbox_1 (IC20.1), rj50 (IC6.1 RP3.7)
RJ3_I2C2_SCL/UART3_TX: sensorbox_1 (IC21.2), rj50 (IC11.6 RP6.7)
RJ3_I2C2_SDA/UART3_RX: sensorbox_1 (IC21.5), rj50 (IC11.4 RP6.6)
SIM_CLK: sensorbox_1 (C16.1 CON4.C3 IC3.16 IC9.4), alt_modem (IC22.6 IC29.12)
SIM_DATA: sensorbox_1 (CON4.C6 IC3.25 IC9.1), alt_modem (IC22.4 IC29.10)
SIM_RST: sensorbox_1 (C15.1 CON4.C2 IC3.15 IC9.6), alt_modem (IC22.2 IC29.13)
SIM_VCC: sensorbox_1 (C14.1 CON4.C1 IC3.24 IC9.3), alt_modem (IC22.8 IC29.11)
SKM53_Rx: mikrokontroler (IC1.42), sensorbox_1 (IC2.6 IC16.10)
SKM53_Tx: mikrokontroler (IC1.43), sensorbox_1 (IC2.5 IC16.9)
SPI1_MISO/ADC_CH7: mikrokontroler (IC1.22), sensorbox_1 (IC20.4)
SPI1_MOSI/ADC_CH8: mikrokontroler (IC1.23), sensorbox_1 (IC21.14)
SPI1_NSS/ADC_CH5: mikrokontroler (IC1.20), sensorbox_1 (IC20.14)
SPI1_SCK/ADC_CH6: mikrokontroler (IC1.21), sensorbox_1 (IC20.15)
SPI2_MISO: mikrokontroler (IC1.35), rj50 (IC10.4 RP5.6)
SPI2_MOSI/DISP_D0: mikrokontroler (IC1.36), supply_kbd_lcd (DISP1.7), rj50 (IC10.3 RP5.5)
SPI2_NSS/DISP_RW: mikrokontroler (IC1.33), supply_kbd_lcd (DISP1.5), rj50 (IC8.1 RP5.8)
SPI2_SCK: mikrokontroler (IC1.34), rj50 (IC10.6 RP5.7)
TIM2_CH1_ETR/SPI1_NSS: mikrokontroler (IC1.50 P15.5), supply_kbd_lcd (Q5.1 R15.2)
USB_D+: mikrokontroler (IC1.45), supply_kbd_lcd (IC15.2 J5.3)
USB_D-: mikrokontroler (IC1.44), supply_kbd_lcd (IC15.3 J5.2)

## Assembly variants
standard: not fitted IC2 IC3 IC9 IC22 J1 R17